# Altium schematic sheet Wireless_ECG_Monitor.SchDoc
size A4; SheetNumber: 1; SheetTotal: 7
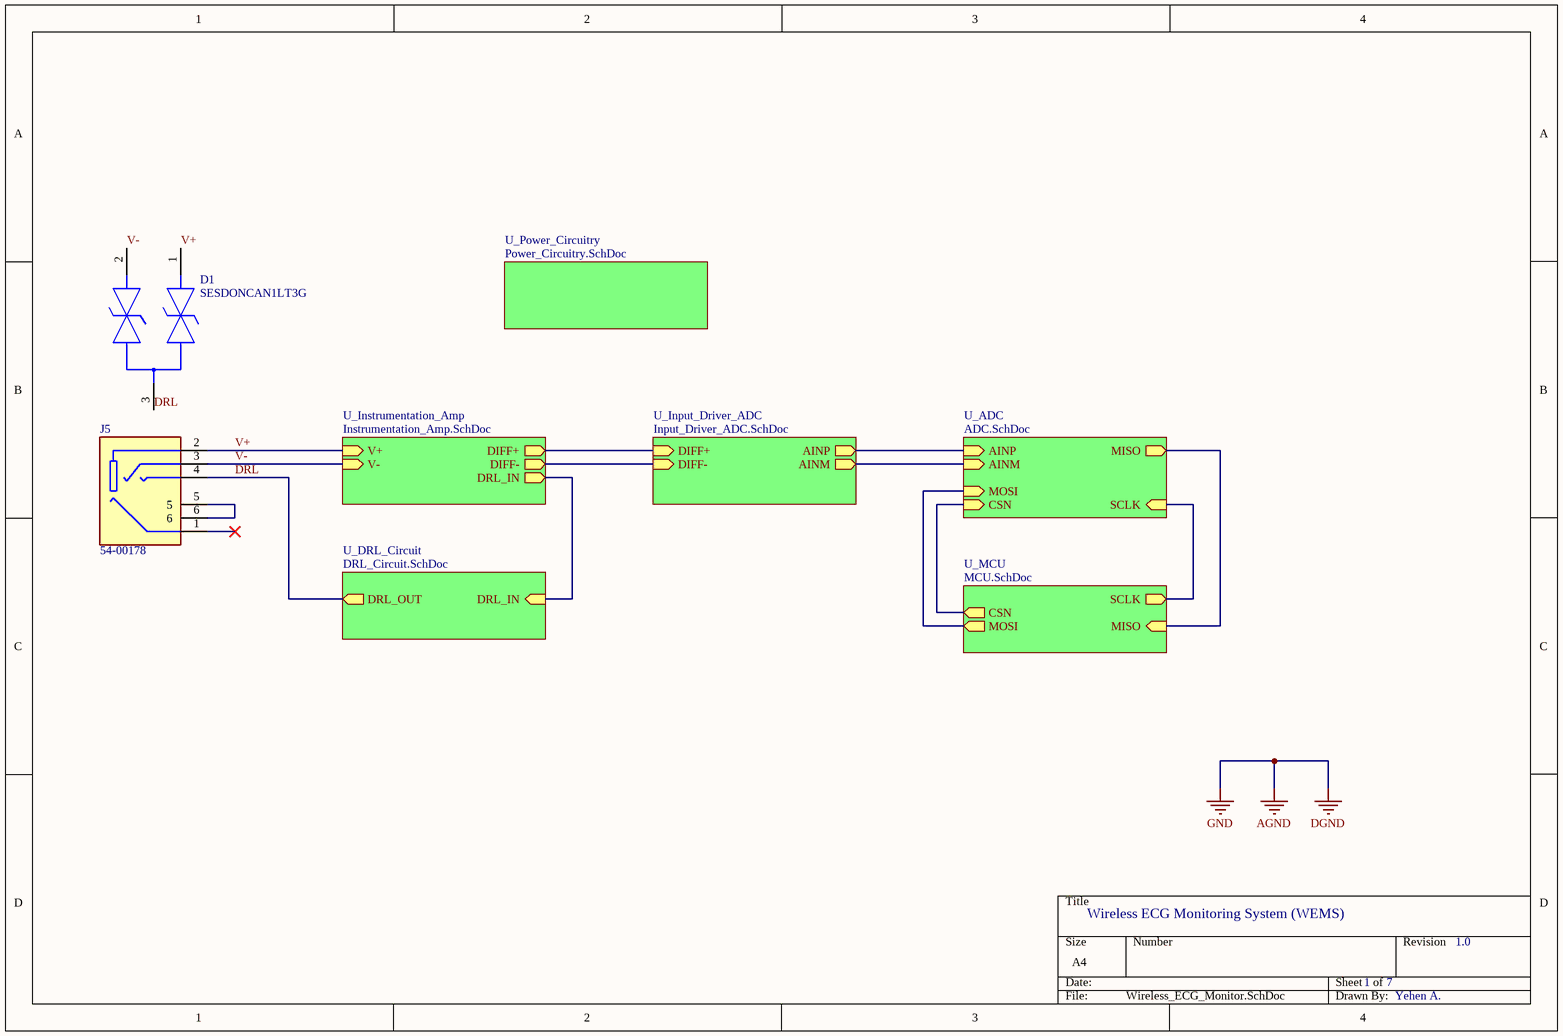
[diagram p0: Wireless_ECG_Monitor.SchDoc]

## Parts
D1  SESDONCAN1LT3G  [FP-318-MFG]
J5  54-00178  [54-00178]

## Sub-sheets
U_ADC = ADC.SchDoc: AINM (in), AINP (in), MISO (out), SCLK (in), CSN (in), MOSI (in)
U_DRL_Circuit = DRL_Circuit.SchDoc: DRL_IN (in), DRL_OUT (out)
U_Input_Driver_ADC = Input_Driver_ADC.SchDoc: DIFF+ (in), DIFF- (in), AINP (out), AINM (out)
U_Instrumentation_Amp = Instrumentation_Amp.SchDoc: DIFF+ (out), DIFF- (out), DRL_IN (out), V+ (in), V- (in)
U_MCU = MCU.SchDoc: CSN (out), SCLK (out), MISO (in), MOSI (out)
U_Power_Circuitry = Power_Circuitry.SchDoc: no entries

## Nets
DRL: D1.3 J5.4 ; sheet U_DRL_Circuit/DRL_OUT
V+: D1.1 J5.2 ; sheet U_Instrumentation_Amp/V+
V-: D1.2 J5.3 ; sheet U_Instrumentation_Amp/V-
NetJ5_5: J5.5 J5.6
(unnamed): sheet U_DRL_Circuit/DRL_IN, sheet U_Instrumentation_Amp/DRL_IN
(unnamed): sheet U_Input_Driver_ADC/DIFF+, sheet U_Instrumentation_Amp/DIFF+
(unnamed): sheet U_Input_Driver_ADC/DIFF-, sheet U_Instrumentation_Amp/DIFF-
(unnamed): sheet U_Input_Driver_ADC/AINP, sheet U_ADC/AINP
(unnamed): sheet U_Input_Driver_ADC/AINM, sheet U_ADC/AINM
(unnamed): sheet U_MCU/CSN, sheet U_ADC/CSN
(unnamed): sheet U_MCU/SCLK, sheet U_ADC/SCLK
(unnamed): sheet U_MCU/MISO, sheet U_ADC/MISO
(unnamed): sheet U_MCU/MOSI, sheet U_ADC/MOSI

Not connected (* = marked no-connect by the designer): J5 1*

## Notes on the sheet
- Wireless ECG Monitoring System (WEMS)
- 1
- 7
- 1.0
- Yehen A.

## Library data of the parts
D1 = CMP-00278-29933148-1: SESDONCAN1LT3G ESD Suppressor Diode TVS Bi-Dir 24V Automotive 3-Pin SOT-23 T/R; Manufacturer Lifecycle Status: ACTIVE; Number of Bidirectional Channels: 2; Peak Pulse Current: 3A; Direction: Bidirectional; Power Line Protection: No; Peak Pulse Power: 200W; Max Junction Temperature (Tj): 150°C; Clamping Voltage: 33.4V; Capacitance: 10pF; Breakdown Voltage: 26.2V; Composition: Zener; Lifecycle Status: Production; RoHS: Compliant; Case/Package: TO-236-3; Reverse Standoff Voltage: 24V; Lead Free: Lead Free; Number of Pins: 3; Height: 1.11mm; Mount: Surface Mount; Min Breakdown Voltage: 26.2V; Max Operating Temperature: 150°C; Min Operating Temperature: -55°C; Number of Channels: 2; NexarPartId: 29933148
J5 = 54-00178: Conn Jack Stereo 3.5MM SMD R/a; Manufacturer: Tensility; Supplier: DigiKey; Supplier Part Number: 839-54-00178CT-ND; Manufacturer Part Number: 54-00178; Category: Connectors; Stock: 11344; Pricing: 1=0.83, 10=0.709, 25=0.6644, 50=0.6328, 100=0.6025, 250=0.56468, 500=0.5377 (USD)